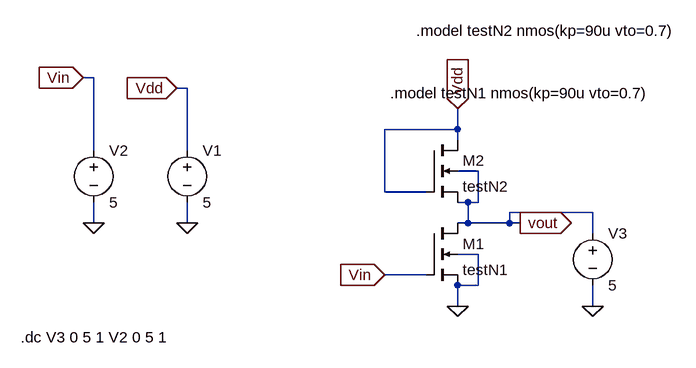
[diagram p0: schematic loadlineMOS.asc]
loadlineMOS.asc, the LTspice schematic file:
Version 4
SHEET 1 880 680
WIRE -464 0 -480 0
WIRE -320 16 -336 16
WIRE 96 80 96 48
WIRE 96 80 -16 80
WIRE 96 96 96 80
WIRE -464 112 -464 0
WIRE -320 112 -320 16
WIRE 128 144 96 144
WIRE -16 176 -16 80
WIRE 48 176 -16 176
WIRE 112 192 96 192
WIRE 128 192 128 144
WIRE 128 192 112 192
WIRE 304 208 176 208
WIRE -464 224 -464 192
WIRE -320 224 -320 192
WIRE 112 224 112 192
WIRE 112 224 96 224
WIRE 176 224 176 208
WIRE 176 224 112 224
WIRE 192 224 176 224
WIRE 304 240 304 208
WIRE 128 272 96 272
WIRE 48 304 -16 304
WIRE 128 320 128 272
WIRE 128 320 96 320
WIRE 96 352 96 320
WIRE 304 352 304 320
FLAG 96 352 0
FLAG 96 48 Vdd
IOPIN 96 48 In
FLAG -16 304 Vin
IOPIN -16 304 In
FLAG -336 16 Vdd
IOPIN -336 16 In
FLAG -480 0 Vin
IOPIN -480 0 In
FLAG -464 224 0
FLAG -320 224 0
FLAG 192 224 vout
IOPIN 192 224 Out
FLAG 304 352 0
SYMBOL nmos4 48 224 R0
SYMATTR InstName M1
SYMATTR Value testN1
SYMATTR Value2 l=45u w=20u
SYMBOL nmos4 48 96 R0
SYMATTR InstName M2
SYMATTR Value testN2
SYMATTR Value2 l=45u w=3u
SYMBOL voltage -320 96 R0
WINDOW 123 0 0 Left 0
WINDOW 39 0 0 Left 0
SYMATTR InstName V1
SYMATTR Value 5
SYMBOL voltage -464 96 R0
WINDOW 123 0 0 Left 0
WINDOW 39 0 0 Left 0
SYMATTR InstName V2
SYMATTR Value 5
SYMBOL voltage 304 224 R0
WINDOW 123 0 0 Left 0
WINDOW 39 0 0 Left 0
SYMATTR InstName V3
SYMATTR Value 5
TEXT -8 24 Left 2 !.model testN1 nmos(kp=90u vto=0.7)
TEXT 32 -72 Left 2 !.model testN2 nmos(kp=90u vto=0.7)
TEXT -576 400 Left 2 !.dc V3 0 5 1 V2 0 5 1

The netlist it stands for:
* loadlineMOS.asc
M1 vout Vin 0 0 testN1 l=45u w=20u
M2 Vdd Vdd vout vout testN2 l=45u w=3u
V1 Vdd 0 5
V2 Vin 0 5
V3 vout 0 5
.model NMOS NMOS
.model PMOS PMOS
.lib standard.mos
.model testN1 nmos(kp=90u vto=0.7)
.model testN2 nmos(kp=90u vto=0.7)
.dc V3 0 5 1 V2 0 5 1
.backanno
.end

* Results of the author's LTspice run, read from the files saved beside the schematic
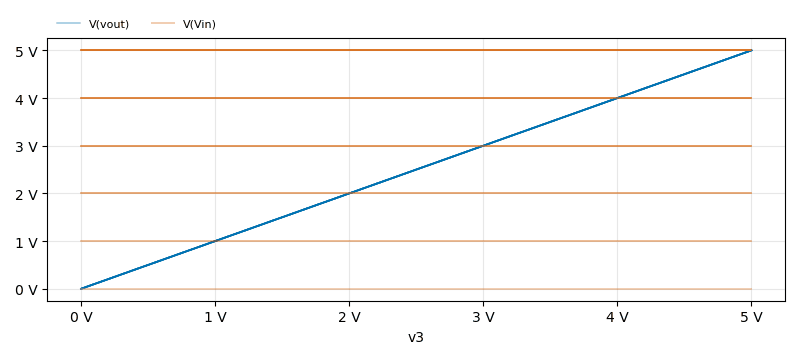
[diagram p1: DC transfer characteristic of loadlineMOS.asc, plotted from the saved traces]
* DC transfer characteristic, 6 runs:
*   V(vout) [v2=0]: 0 V at v3=0 V, 5 V at v3=5 V, min 0 V, max 5 V
*   V(vout) [v2=1]: 0 V at v3=0 V, 5 V at v3=5 V, min 0 V, max 5 V
*   V(vout) [v2=2]: 0 V at v3=0 V, 5 V at v3=5 V, min 0 V, max 5 V
*   V(vout) [v2=3]: 0 V at v3=0 V, 5 V at v3=5 V, min 0 V, max 5 V
*   V(vout) [v2=4]: 0 V at v3=0 V, 5 V at v3=5 V, min 0 V, max 5 V
*   V(vout) [v2=5]: 0 V at v3=0 V, 5 V at v3=5 V, min 0 V, max 5 V
*   V(Vin) [v2=0]: 0 V at v3=0 V, 0 V at v3=5 V, min 0 V, max 0 V
*   V(Vin) [v2=1]: 1 V at v3=0 V, 1 V at v3=5 V, min 1 V, max 1 V
*   V(Vin) [v2=2]: 2 V at v3=0 V, 2 V at v3=5 V, min 2 V, max 2 V
*   V(Vin) [v2=3]: 3 V at v3=0 V, 3 V at v3=5 V, min 3 V, max 3 V
*   V(Vin) [v2=4]: 4 V at v3=0 V, 4 V at v3=5 V, min 4 V, max 4 V
*   V(Vin) [v2=5]: 5 V at v3=0 V, 5 V at v3=5 V, min 5 V, max 5 V